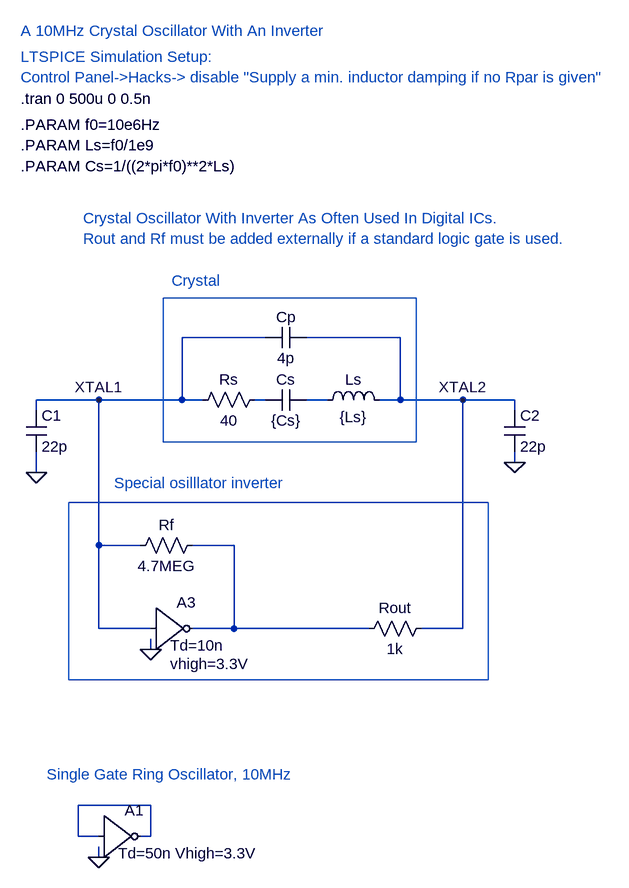
[diagram p0: schematic Crystal_osc_with_inv.asc]
Crystal_osc_with_inv.asc, the LTspice schematic file:
Version 4
SHEET 1 1332 692
WIRE 240 320 208 320
WIRE 208 320 208 272
WIRE 208 272 320 272
WIRE 320 272 320 320
WIRE 320 320 304 320
WIRE 240 336 240 352
WIRE 240 0 320 0
WIRE 384 0 448 0
WIRE 320 16 320 32
WIRE 240 -128 304 -128
WIRE 736 0 800 0
WIRE 880 -272 880 -256
WIRE 880 -352 880 -336
WIRE 400 -352 368 -352
WIRE 880 -352 800 -352
WIRE 800 0 800 -352
WIRE 144 -272 144 -240
WIRE 480 -352 496 -352
WIRE 560 -352 592 -352
WIRE 496 -448 368 -448
WIRE 368 -448 368 -352
WIRE 368 -352 240 -352
WIRE 560 -448 704 -448
WIRE 704 -448 704 -352
WIRE 704 -352 672 -352
WIRE 240 -128 240 0
WIRE 240 -352 144 -352
WIRE 144 -352 144 -336
WIRE 240 -128 240 -352
WIRE 800 -352 704 -352
WIRE 448 -128 448 0
WIRE 448 0 656 0
WIRE 448 -128 384 -128
FLAG 240 352 0
FLAG 320 32 0
FLAG 880 -256 0
FLAG 144 -240 0
FLAG 240 -352 XTAL1
FLAG 800 -352 XTAL2
SYMBOL D:\\wire\\lib\\sym\\Digital\\inv 240 256 R0
WINDOW 3 30 90 Left 0
SYMATTR Value Td=50n Vhigh=3.3V
SYMATTR InstName A1
SYMATTR Value2 tripdt=2n
SYMBOL D:\\wire\\lib\\sym\\Digital\\inv 320 -64 R0
WINDOW 3 30 90 Left 0
WINDOW 39 30 118 Left 0
SYMATTR Value Td=10n
SYMATTR InstName A3
SYMATTR Value2 tripdt=2n
SYMATTR SpiceLine vhigh=3.3V
SYMBOL D:\\wire\\lib\\sym\\res 400 -144 R90
WINDOW 0 0 56 VBottom 0
WINDOW 3 32 56 VTop 0
SYMATTR InstName Rf
SYMATTR Value 4.7MEG
SYMBOL D:\\wire\\lib\\sym\\res 752 -16 R90
WINDOW 0 0 56 VBottom 0
WINDOW 3 32 56 VTop 0
SYMATTR InstName Rout
SYMATTR Value 1k
SYMBOL D:\\wire\\lib\\sym\\cap 864 -336 R0
SYMATTR InstName C2
SYMATTR Value 22p
SYMBOL cap 128 -336 R0
SYMATTR InstName C1
SYMATTR Value 22p
SYMBOL res 384 -336 R270
WINDOW 0 32 56 VTop 0
WINDOW 3 0 56 VBottom 0
SYMATTR InstName Rs
SYMATTR Value 40
SYMBOL cap 496 -336 R270
WINDOW 0 32 32 VTop 0
WINDOW 3 0 32 VBottom 0
SYMATTR InstName Cs
SYMATTR Value {Cs}
SYMBOL ind 576 -336 R270
WINDOW 0 32 56 VTop 0
WINDOW 3 5 56 VBottom 0
SYMATTR InstName Ls
SYMATTR Value {Ls}
SYMBOL cap 496 -432 R270
WINDOW 0 32 32 VTop 0
WINDOW 3 0 32 VBottom 0
SYMATTR InstName Cp
SYMATTR Value 4p
TEXT 120 -816 Left 0 !.tran 0 500u 0 0.5n
TEXT 120 -712 Left 0 !.PARAM Cs=1/((2*pi*f0)**2*Ls)
TEXT 120 -776 Left 0 !.PARAM f0=10e6Hz
TEXT 352 -536 Left 0 ;Crystal
TEXT 264 -224 Left 0 ;Special osilllator inverter
TEXT 120 -744 Left 0 !.PARAM Ls=f0/1e9
TEXT 160 224 Left 0 ;Single Gate Ring Oscillator, 10MHz
TEXT 216 -632 Left 0 ;Crystal Oscillator With Inverter As Often Used In Digital ICs.
TEXT 216 -600 Left 0 ;Rout and Rf must be added externally if a standard logic gate is used.
TEXT 120 -880 Left 0 ;LTSPICE Simulation Setup:\nControl Panel->Hacks-> disable "Supply a min. inductor damping if no Rpar is given"
TEXT 120 -920 Left 0 ;A 10MHz Crystal Oscillator With An Inverter
RECTANGLE Normal 728 -287 339 -509
RECTANGLE Normal 839 79 194 -194

The netlist it stands for:
* Crystal_osc_with_inv.asc
A1 N001 0 0 0 0 N001 0 0 BUF Td=50n Vhigh=3.3V tripdt=2n
A3 XTAL1 0 0 0 0 N002 0 0 BUF Td=10n tripdt=2n vhigh=3.3V
Rf N002 XTAL1 4.7MEG
Rout XTAL2 N002 1k
C2 XTAL2 0 22p
C1 XTAL1 0 22p
Rs XTAL1 N003 40
Cs N003 N004 {Cs}
Ls N004 XTAL2 {Ls}
Cp XTAL1 XTAL2 4p
.tran 0 500u 0 0.5n
.PARAM Cs=1/((2*pi*f0)**2*Ls)
.PARAM f0=10e6Hz
* Crystal
* Special osilllator inverter
.PARAM Ls=f0/1e9
* Single Gate Ring Oscillator, 10MHz
* Crystal Oscillator With Inverter As Often Used In Digital ICs.
* Rout and Rf must be added externally if a standard logic gate is used.
* LTSPICE Simulation Setup:
* Control Panel->Hacks-> disable "Supply a min. inductor damping if no Rpar is given"
* A 10MHz Crystal Oscillator With An Inverter
.backanno
.end